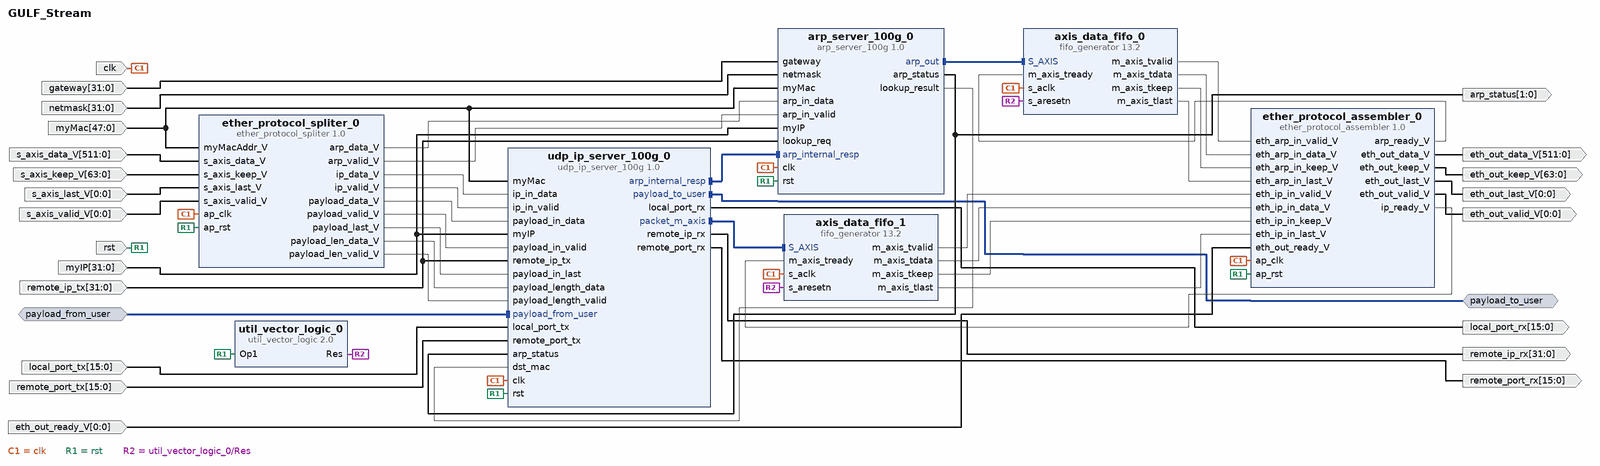
[diagram p0: block diagram of the top level]
# Vivado block design GULF_Stream, xczu19eg-ffvc1760-2-i, Vivado 2019.1
create_bd_design GULF_Stream

create_bd_intf_port -mode Master -vlnv xilinx.com:interface:axis_rtl:1.0 payload_to_user
create_bd_intf_port -mode Slave -vlnv xilinx.com:interface:axis_rtl:1.0 payload_from_user
set_property -dict [list \
  CONFIG.HAS_TKEEP 1 \
  CONFIG.HAS_TLAST 1 \
  CONFIG.HAS_TREADY 1 \
  CONFIG.HAS_TSTRB 0 \
  CONFIG.LAYERED_METADATA undef \
  CONFIG.TDATA_NUM_BYTES 64 \
  CONFIG.TDEST_WIDTH 0 \
  CONFIG.TID_WIDTH 0 \
  CONFIG.TUSER_WIDTH 0 \
] [get_bd_intf_ports payload_from_user]
create_bd_port -dir I -type clk clk
create_bd_port -dir I -type rst rst
set_property -dict {CONFIG.POLARITY ACTIVE_HIGH} [get_bd_ports rst]
create_bd_port -dir I -from 511 -to 0 -type data s_axis_data_V
create_bd_port -dir I -from 63 -to 0 -type data s_axis_keep_V
create_bd_port -dir I -from 0 -to 0 -type data s_axis_last_V
create_bd_port -dir I -from 0 -to 0 -type data s_axis_valid_V
create_bd_port -dir O -from 511 -to 0 -type data eth_out_data_V
create_bd_port -dir O -from 63 -to 0 -type data eth_out_keep_V
create_bd_port -dir O -from 0 -to 0 -type data eth_out_valid_V
create_bd_port -dir O -from 0 -to 0 -type data eth_out_last_V
create_bd_port -dir I -from 0 -to 0 -type data eth_out_ready_V
create_bd_port -dir I -from 31 -to 0 gateway
create_bd_port -dir I -from 31 -to 0 myIP
create_bd_port -dir I -from 47 -to 0 myMac
create_bd_port -dir I -from 31 -to 0 netmask
create_bd_port -dir I -from 15 -to 0 local_port_tx
create_bd_port -dir I -from 31 -to 0 remote_ip_tx
create_bd_port -dir I -from 15 -to 0 remote_port_tx
create_bd_port -dir O -from 15 -to 0 local_port_rx
create_bd_port -dir O -from 31 -to 0 remote_ip_rx
create_bd_port -dir O -from 15 -to 0 remote_port_rx
create_bd_port -dir O -from 1 -to 0 arp_status

create_bd_cell -type ip -vlnv xilinx.com:ip:util_vector_logic:2.0 util_vector_logic_0
set_property -dict {CONFIG.C_OPERATION not CONFIG.C_SIZE 1} [get_bd_cells util_vector_logic_0]
create_bd_cell -type ip -vlnv clarkshen.com:user:udp_ip_server_100g:1.0 udp_ip_server_100g_0
create_bd_cell -type ip -vlnv clarkshen.com:user:arp_server_100g:1.0 arp_server_100g_0
create_bd_cell -type ip -vlnv xilinx.com:hls:ether_protocol_spliter:1.0 ether_protocol_spliter_0
create_bd_cell -type ip -vlnv xilinx.com:hls:ether_protocol_assembler:1.0 ether_protocol_assembler_0
create_bd_cell -type ip -vlnv xilinx.com:ip:fifo_generator:13.2 axis_data_fifo_0
set_property -dict [list \
  CONFIG.Enable_TLAST true \
  CONFIG.FIFO_Application_Type_axis Low_Latency_Data_FIFO \
  CONFIG.FIFO_Implementation_axis Common_Clock_Distributed_RAM \
  CONFIG.FIFO_Implementation_rach Common_Clock_Distributed_RAM \
  CONFIG.FIFO_Implementation_rdch Common_Clock_Builtin_FIFO \
  CONFIG.FIFO_Implementation_wach Common_Clock_Distributed_RAM \
  CONFIG.FIFO_Implementation_wdch Common_Clock_Builtin_FIFO \
  CONFIG.FIFO_Implementation_wrch Common_Clock_Distributed_RAM \
  CONFIG.HAS_TKEEP true \
  CONFIG.INTERFACE_TYPE AXI_STREAM \
  CONFIG.Input_Depth_axis 16 \
  CONFIG.TDATA_NUM_BYTES 64 \
  CONFIG.TUSER_WIDTH 0 \
] [get_bd_cells axis_data_fifo_0]
create_bd_cell -type ip -vlnv xilinx.com:ip:fifo_generator:13.2 axis_data_fifo_1
set_property -dict [list \
  CONFIG.Enable_TLAST true \
  CONFIG.FIFO_Application_Type_axis Low_Latency_Data_FIFO \
  CONFIG.FIFO_Implementation_axis Common_Clock_Distributed_RAM \
  CONFIG.FIFO_Implementation_rach Common_Clock_Distributed_RAM \
  CONFIG.FIFO_Implementation_rdch Common_Clock_Builtin_FIFO \
  CONFIG.FIFO_Implementation_wach Common_Clock_Distributed_RAM \
  CONFIG.FIFO_Implementation_wdch Common_Clock_Builtin_FIFO \
  CONFIG.FIFO_Implementation_wrch Common_Clock_Distributed_RAM \
  CONFIG.HAS_TKEEP true \
  CONFIG.INTERFACE_TYPE AXI_STREAM \
  CONFIG.Input_Depth_axis 16 \
  CONFIG.TDATA_NUM_BYTES 64 \
  CONFIG.TUSER_WIDTH 0 \
] [get_bd_cells axis_data_fifo_1]

# ---- connections ----

connect_bd_intf_net [get_bd_intf_ports payload_to_user] [get_bd_intf_pins udp_ip_server_100g_0/payload_to_user]
connect_bd_intf_net -intf_net payload_from_user_0_1 [get_bd_intf_ports payload_from_user] [get_bd_intf_pins udp_ip_server_100g_0/payload_from_user]
connect_bd_intf_net [get_bd_intf_pins arp_server_100g_0/arp_out] [get_bd_intf_pins axis_data_fifo_0/S_AXIS]
connect_bd_intf_net [get_bd_intf_pins udp_ip_server_100g_0/packet_m_axis] [get_bd_intf_pins axis_data_fifo_1/S_AXIS]
connect_bd_intf_net [get_bd_intf_pins udp_ip_server_100g_0/arp_internal_resp] [get_bd_intf_pins arp_server_100g_0/arp_internal_resp]
connect_bd_net -net clk_0_1 [get_bd_ports clk] \
  [get_bd_pins arp_server_100g_0/clk] [get_bd_pins udp_ip_server_100g_0/clk] [get_bd_pins ether_protocol_assembler_0/ap_clk] \
  [get_bd_pins ether_protocol_spliter_0/ap_clk] [get_bd_pins axis_data_fifo_0/s_aclk] [get_bd_pins axis_data_fifo_1/s_aclk]
connect_bd_net -net rst_0_1 [get_bd_ports rst] \
  [get_bd_pins arp_server_100g_0/rst] [get_bd_pins util_vector_logic_0/Op1] [get_bd_pins ether_protocol_assembler_0/ap_rst] \
  [get_bd_pins ether_protocol_spliter_0/ap_rst] [get_bd_pins udp_ip_server_100g_0/rst]
connect_bd_net -net s_axis_data_V_0_1 [get_bd_ports s_axis_data_V] [get_bd_pins ether_protocol_spliter_0/s_axis_data_V]
connect_bd_net -net s_axis_keep_V_0_1 [get_bd_ports s_axis_keep_V] [get_bd_pins ether_protocol_spliter_0/s_axis_keep_V]
connect_bd_net -net s_axis_last_V_0_1 [get_bd_ports s_axis_last_V] [get_bd_pins ether_protocol_spliter_0/s_axis_last_V]
connect_bd_net -net s_axis_valid_V_0_1 [get_bd_ports s_axis_valid_V] [get_bd_pins ether_protocol_spliter_0/s_axis_valid_V]
connect_bd_net [get_bd_pins ether_protocol_assembler_0/eth_out_data_V] [get_bd_ports eth_out_data_V]
connect_bd_net [get_bd_pins ether_protocol_assembler_0/eth_out_keep_V] [get_bd_ports eth_out_keep_V]
connect_bd_net [get_bd_pins ether_protocol_assembler_0/eth_out_valid_V] [get_bd_ports eth_out_valid_V]
connect_bd_net [get_bd_pins ether_protocol_assembler_0/eth_out_last_V] [get_bd_ports eth_out_last_V]
connect_bd_net -net eth_out_ready_V_0_1 [get_bd_ports eth_out_ready_V] [get_bd_pins ether_protocol_assembler_0/eth_out_ready_V]
connect_bd_net -net gateway_0_1 [get_bd_ports gateway] [get_bd_pins arp_server_100g_0/gateway]
connect_bd_net -net myIP_0_1 [get_bd_ports myIP] [get_bd_pins arp_server_100g_0/myIP] [get_bd_pins udp_ip_server_100g_0/myIP]
connect_bd_net -net myMac_0_1 [get_bd_ports myMac] \
  [get_bd_pins arp_server_100g_0/myMac] [get_bd_pins ether_protocol_spliter_0/myMacAddr_V] \
  [get_bd_pins udp_ip_server_100g_0/myMac]
connect_bd_net -net netmask_0_1 [get_bd_ports netmask] [get_bd_pins arp_server_100g_0/netmask]
connect_bd_net -net local_port_tx_0_1 [get_bd_ports local_port_tx] [get_bd_pins udp_ip_server_100g_0/local_port_tx]
connect_bd_net -net remote_ip_tx_0_1 [get_bd_ports remote_ip_tx] \
  [get_bd_pins udp_ip_server_100g_0/remote_ip_tx] [get_bd_pins arp_server_100g_0/lookup_req]
connect_bd_net -net remote_port_tx_0_1 [get_bd_ports remote_port_tx] [get_bd_pins udp_ip_server_100g_0/remote_port_tx]
connect_bd_net [get_bd_pins udp_ip_server_100g_0/local_port_rx] [get_bd_ports local_port_rx]
connect_bd_net [get_bd_pins udp_ip_server_100g_0/remote_ip_rx] [get_bd_ports remote_ip_rx]
connect_bd_net [get_bd_pins udp_ip_server_100g_0/remote_port_rx] [get_bd_ports remote_port_rx]
connect_bd_net [get_bd_pins arp_server_100g_0/arp_status] [get_bd_ports arp_status] [get_bd_pins udp_ip_server_100g_0/arp_status]
connect_bd_net [get_bd_pins util_vector_logic_0/Res] [get_bd_pins axis_data_fifo_0/s_aresetn] [get_bd_pins axis_data_fifo_1/s_aresetn]
connect_bd_net [get_bd_pins ether_protocol_spliter_0/arp_data_V] [get_bd_pins arp_server_100g_0/arp_in_data]
connect_bd_net [get_bd_pins ether_protocol_spliter_0/arp_valid_V] [get_bd_pins arp_server_100g_0/arp_in_valid]
connect_bd_net [get_bd_pins ether_protocol_spliter_0/ip_data_V] [get_bd_pins udp_ip_server_100g_0/ip_in_data]
connect_bd_net [get_bd_pins ether_protocol_spliter_0/ip_valid_V] [get_bd_pins udp_ip_server_100g_0/ip_in_valid]
connect_bd_net [get_bd_pins ether_protocol_spliter_0/payload_data_V] [get_bd_pins udp_ip_server_100g_0/payload_in_data]
connect_bd_net [get_bd_pins ether_protocol_spliter_0/payload_valid_V] [get_bd_pins udp_ip_server_100g_0/payload_in_valid]
connect_bd_net [get_bd_pins ether_protocol_spliter_0/payload_last_V] [get_bd_pins udp_ip_server_100g_0/payload_in_last]
connect_bd_net [get_bd_pins ether_protocol_spliter_0/payload_len_data_V] [get_bd_pins udp_ip_server_100g_0/payload_length_data]
connect_bd_net [get_bd_pins ether_protocol_spliter_0/payload_len_valid_V] [get_bd_pins udp_ip_server_100g_0/payload_length_valid]
connect_bd_net [get_bd_pins arp_server_100g_0/lookup_result] [get_bd_pins udp_ip_server_100g_0/dst_mac]
connect_bd_net [get_bd_pins axis_data_fifo_0/m_axis_tvalid] [get_bd_pins ether_protocol_assembler_0/eth_arp_in_valid_V]
connect_bd_net [get_bd_pins ether_protocol_assembler_0/arp_ready_V] [get_bd_pins axis_data_fifo_0/m_axis_tready]
connect_bd_net [get_bd_pins axis_data_fifo_0/m_axis_tdata] [get_bd_pins ether_protocol_assembler_0/eth_arp_in_data_V]
connect_bd_net [get_bd_pins axis_data_fifo_0/m_axis_tkeep] [get_bd_pins ether_protocol_assembler_0/eth_arp_in_keep_V]
connect_bd_net [get_bd_pins axis_data_fifo_0/m_axis_tlast] [get_bd_pins ether_protocol_assembler_0/eth_arp_in_last_V]
connect_bd_net [get_bd_pins axis_data_fifo_1/m_axis_tvalid] [get_bd_pins ether_protocol_assembler_0/eth_ip_in_valid_V]
connect_bd_net [get_bd_pins ether_protocol_assembler_0/ip_ready_V] [get_bd_pins axis_data_fifo_1/m_axis_tready]
connect_bd_net [get_bd_pins axis_data_fifo_1/m_axis_tdata] [get_bd_pins ether_protocol_assembler_0/eth_ip_in_data_V]
connect_bd_net [get_bd_pins axis_data_fifo_1/m_axis_tkeep] [get_bd_pins ether_protocol_assembler_0/eth_ip_in_keep_V]
connect_bd_net [get_bd_pins axis_data_fifo_1/m_axis_tlast] [get_bd_pins ether_protocol_assembler_0/eth_ip_in_last_V]

validate_bd_design
save_bd_design
